# Altium schematic sheet Mezzanine.SchDoc: Mezzanine
size A3; DocumentNumber: 10; Revision: A; SheetNumber: 10; SheetTotal: 10
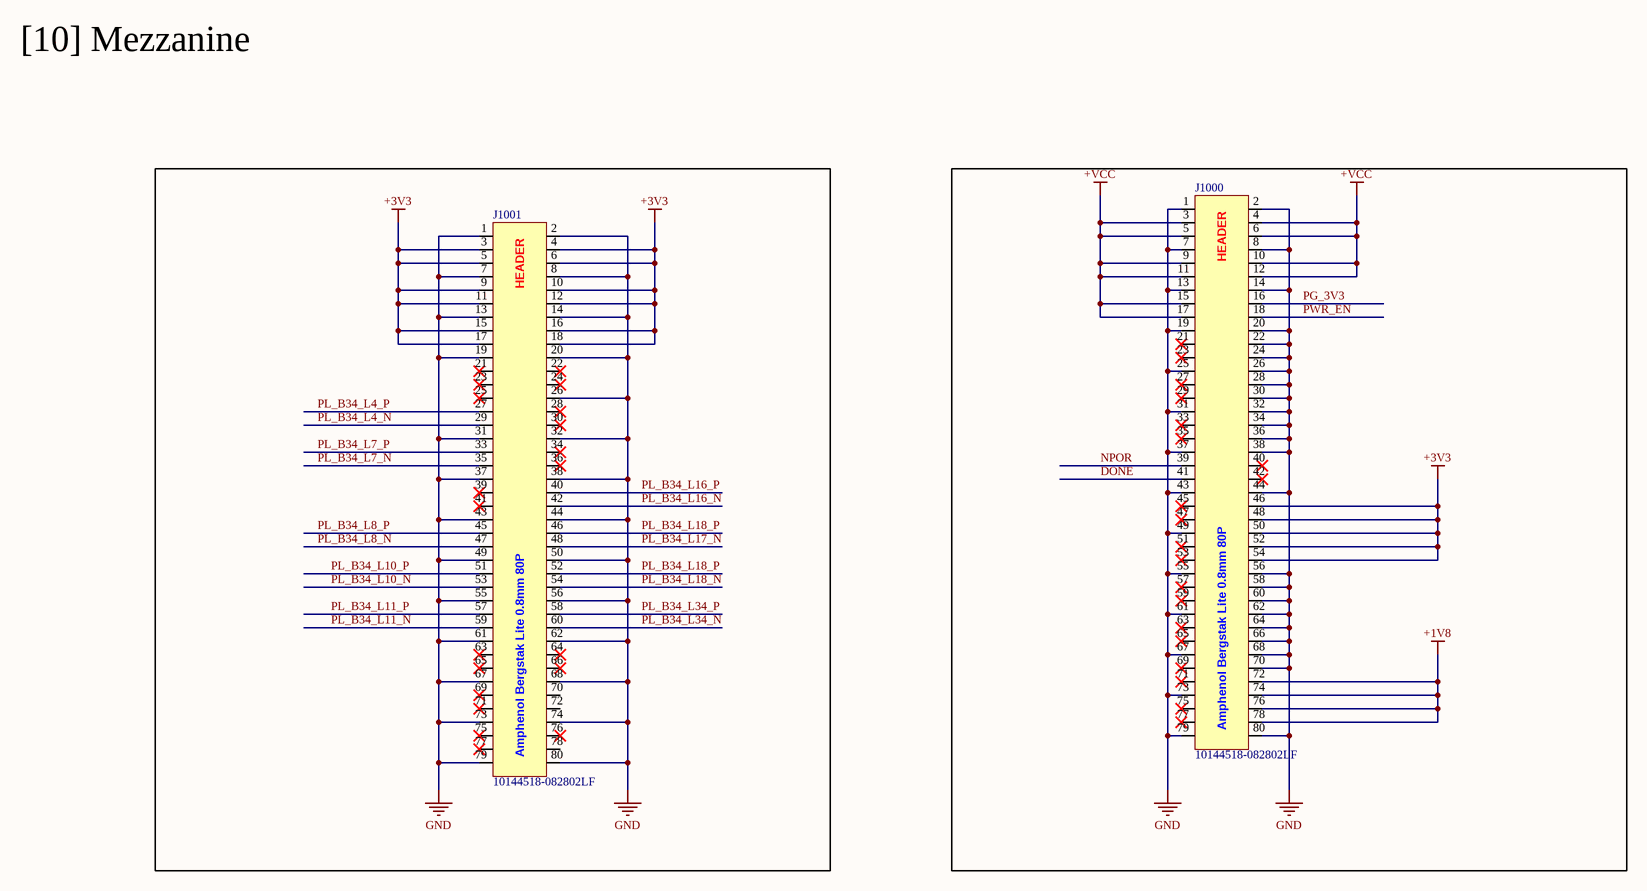
[diagram p0: Mezzanine.SchDoc]

## Parts
J1000  10144518-082802LF  [10144518-082802LF]
J1001  10144518-082802LF  [10144518-082802LF]

## Nets
+1V8: J1000.72 J1000.74 J1000.76 J1000.78
+3V3: J1000.46 J1000.48 J1000.50 J1000.52 J1000.54 J1001.3 J1001.4 J1001.5 J1001.6 J1001.9 J1001.10 J1001.11 J1001.12 J1001.15 J1001.16 J1001.17 J1001.18
+VCC: J1000.3 J1000.4 J1000.5 J1000.6 J1000.9 J1000.10 J1000.11 J1000.12 J1000.15 J1000.17
GND: J1000.1 J1000.2 J1000.7 J1000.8 J1000.13 J1000.14 J1000.19 J1000.20 J1000.22 J1000.24 J1000.25 J1000.26 J1000.28 J1000.30 J1000.31 J1000.32 J1000.34 J1000.36 J1000.37 J1000.38 J1000.43 J1000.44 J1000.49 J1000.55 J1000.56 J1000.58 J1000.60 J1000.61 J1000.62 J1000.64 J1000.66 J1000.67 J1000.68 J1000.70 J1000.73 J1000.79 J1000.80 J1001.1 J1001.2 J1001.7 J1001.8 J1001.13 J1001.14 J1001.19 J1001.20 J1001.26 J1001.31 J1001.32 J1001.37 J1001.38 J1001.43 J1001.44 J1001.49 J1001.50 J1001.55 J1001.56 J1001.61 J1001.62 J1001.67 J1001.68 J1001.73 J1001.74 J1001.79 J1001.80
DONE: J1000.41
NPOR: J1000.39
PG_3V3: J1000.16
PL_B34_L4_N: J1001.29
PL_B34_L4_P: J1001.27
PL_B34_L7_N: J1001.35
PL_B34_L7_P: J1001.33
PL_B34_L8_N: J1001.47
PL_B34_L8_P: J1001.45
PL_B34_L10_N: J1001.53
PL_B34_L10_P: J1001.51
PL_B34_L11_N: J1001.59
PL_B34_L11_P: J1001.57
PL_B34_L16_N: J1001.42
PL_B34_L16_P: J1001.40
PL_B34_L17_N: J1001.48
PL_B34_L18_N: J1001.54
PL_B34_L18_P: J1001.46 J1001.52
PL_B34_L34_N: J1001.60
PL_B34_L34_P: J1001.58
PWR_EN: J1000.18

Not connected (* = marked no-connect by the designer): J1000 21* 23* 27* 29* 33* 35* 40* 42* 45* 47* 51* 53* 57* 59* 63* 65* 69* 71* 75* 77*; J1001 21* 22* 23* 24* 25* 28* 30* 34* 36* 39* 41* 63* 64* 65* 66* 69* 70 71* 72 75* 76* 77* 78

## Notes on the sheet
- [10] Mezzanine
- Title
- Size:
- Date:
- A3
- Number:
- Time:
- Revision:
- Sheet
- of
- File:
- (in symbol 10144518-082802LF) HEADER; Amphenol Bergstak Lite 0.8mm 80P

## Library data of the parts
J1000 J1001 = 10144518-082802LF: BergStak® Lite 0.80mm, Board-to-Board Connector, 80 Positions, Dual Row, Vertical Header; Manufacturer: Amphenol; Manufacturer Part Number: 10144518-082802LF